# EasyEDA Pro project ProPrj_Inverted_MAML_6x6_2026-08-15.epro, schematic DAC_8BIT
Create Date: 2026-06-15; Page Name: P1; Project Name: Inverted_MAML_6x6; Schematic Name: Schematic1; Update Date: 2026-06-15; Company: EasyEDA.com; Drawn: Olle Welin; Page Size: A4; Version: V1.0
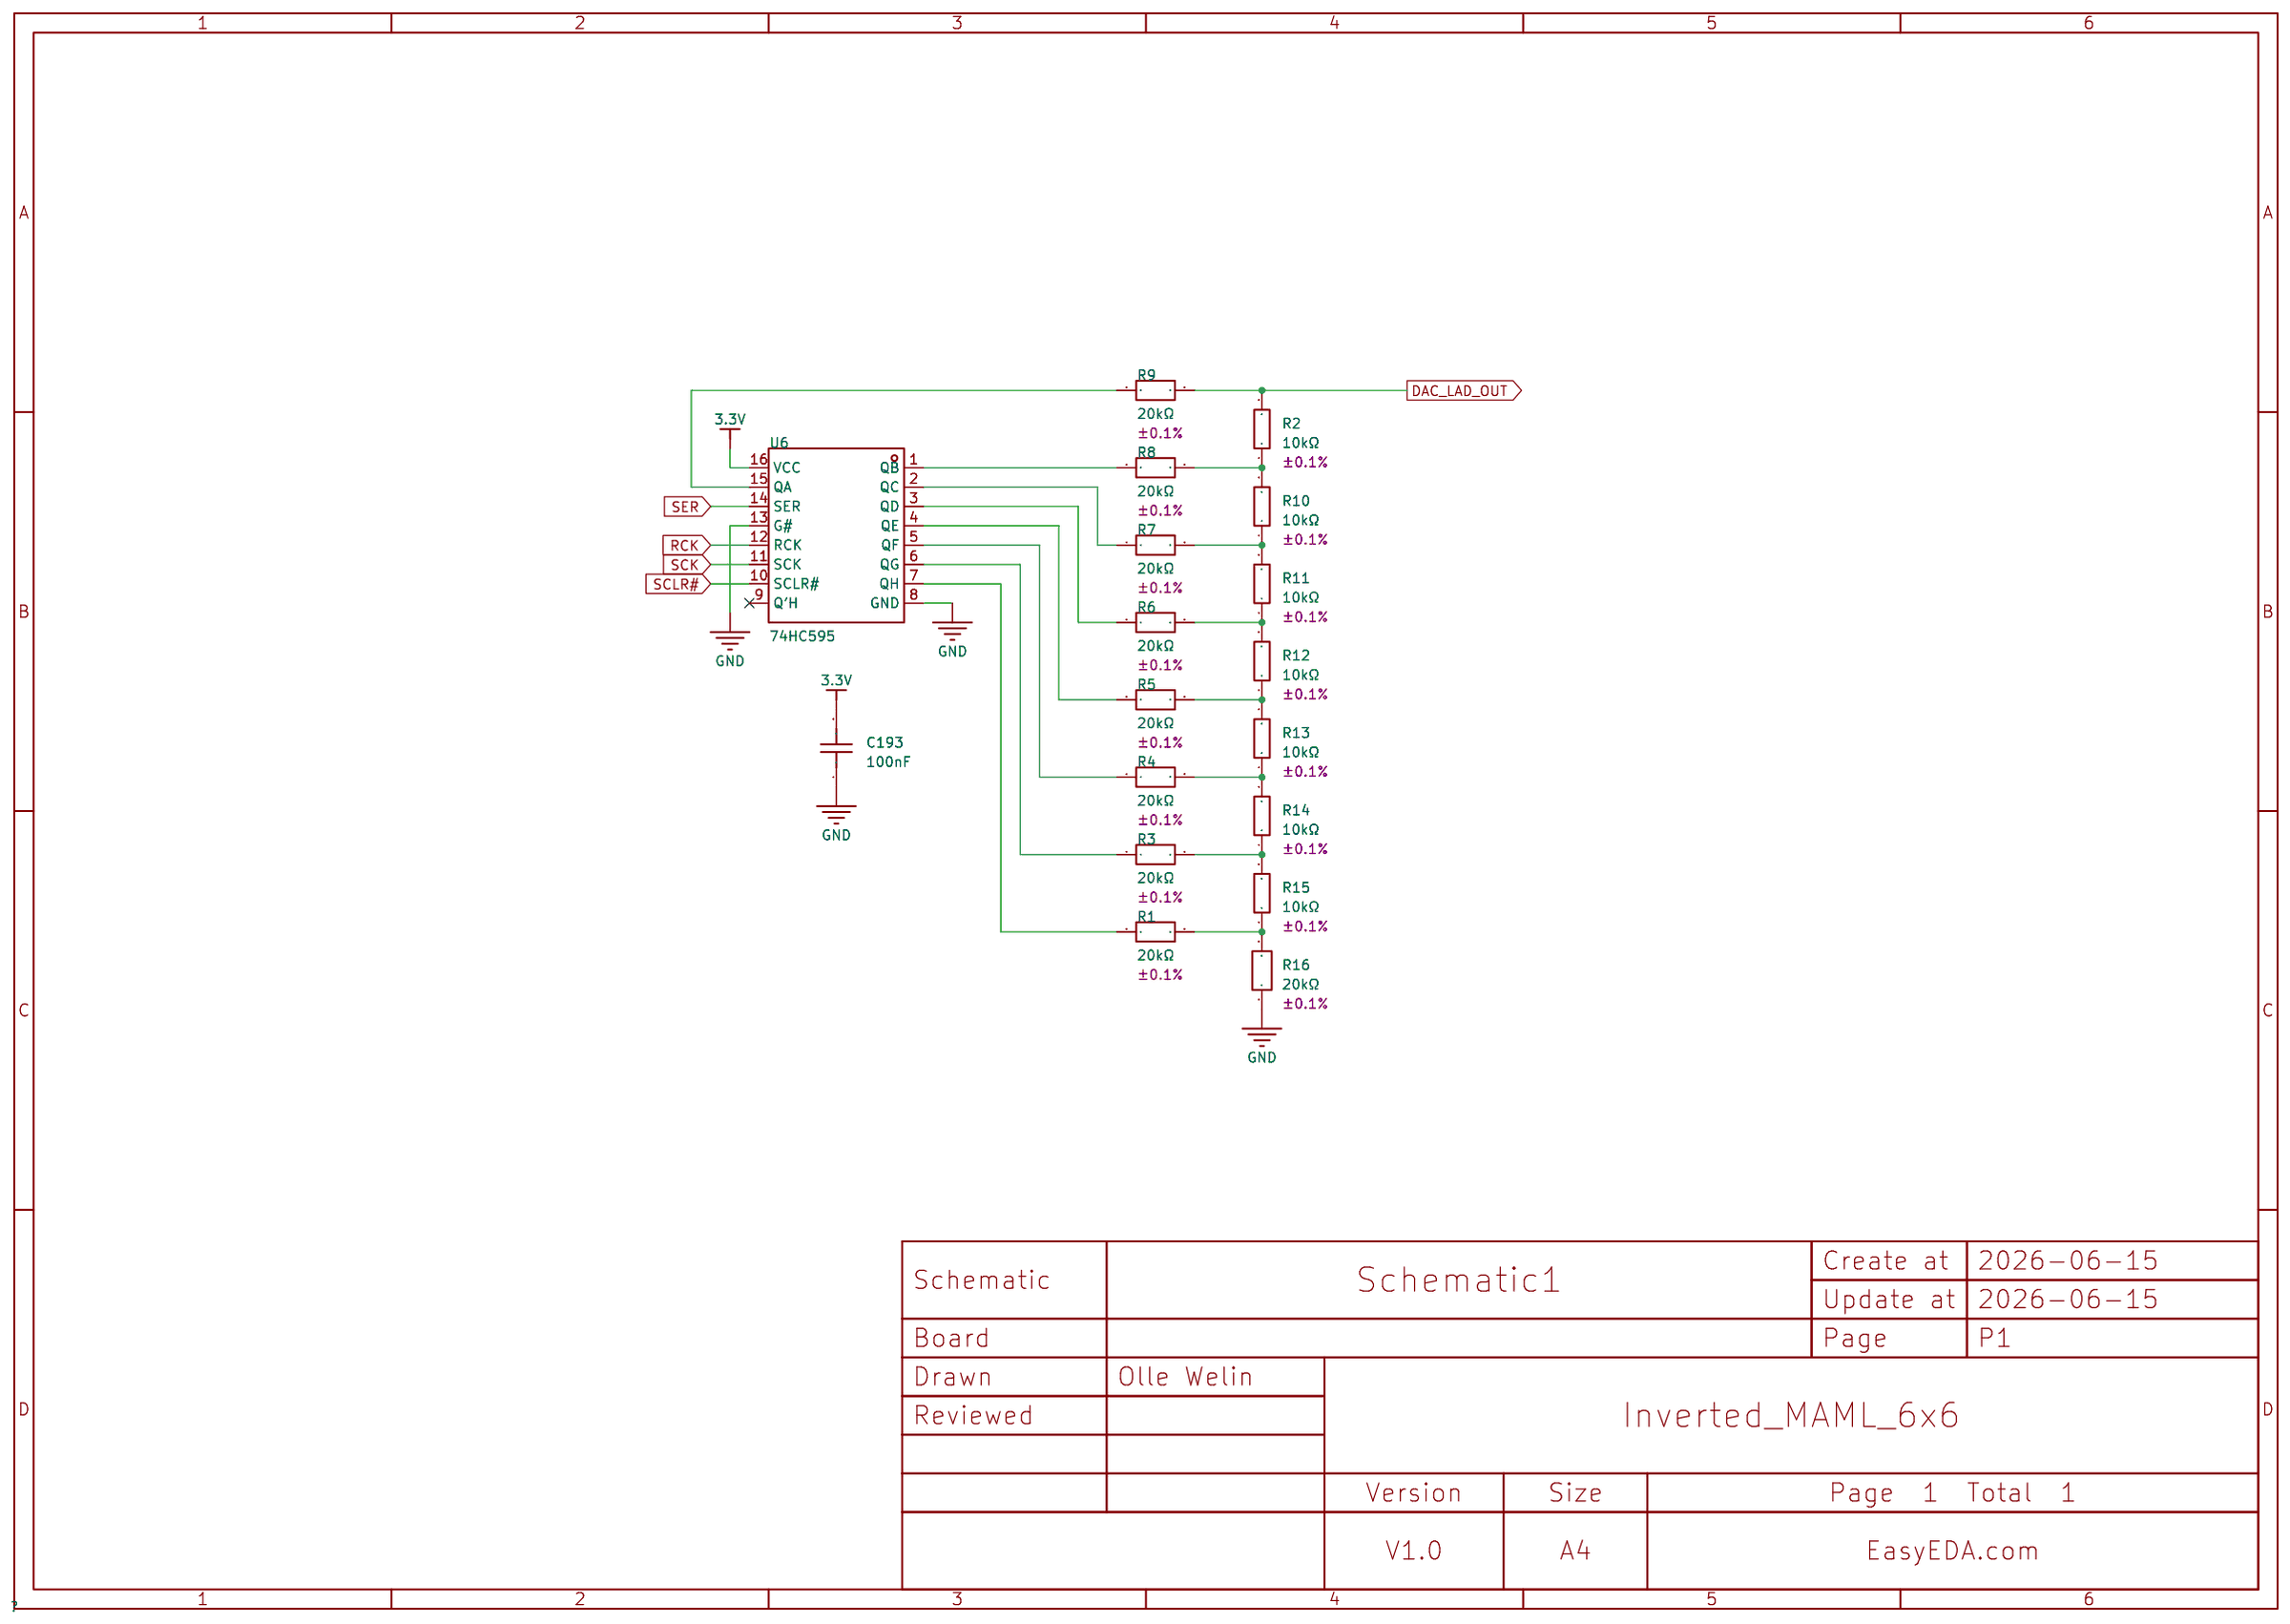
[diagram p6: schematic sheet]

## Parts
C193  100nF  [C0402]
R1  20kΩ  [R0402]
R2  10kΩ  [R0402]
R3  20kΩ  [R0402]
R4  20kΩ  [R0402]
R5  20kΩ  [R0402]
R6  20kΩ  [R0402]
R7  20kΩ  [R0402]
R8  20kΩ  [R0402]
R9  20kΩ  [R0402]
R10  10kΩ  [R0402]
R11  10kΩ  [R0402]
R12  10kΩ  [R0402]
R13  10kΩ  [R0402]
R14  10kΩ  [R0402]
R15  10kΩ  [R0402]
R16  20kΩ  [R0402]
U6  74HC595  [SOP-16_L9.9-W3.9-P1.27-LS6.0-BL]

## Library data of the parts
C193 = CL05B104KO5NNNC: Capacitance:100nF Tolerance:±10% Tolerance:±10% Voltage Rating:16V Temperature Coefficient:X7R; LCSC Part Name: 100nF ±10% 16V; Supplier Part: C1525; Manufacturer: SAMSUNG(三星); Supplier Footprint: 0402; JLCPCB Part Class: Basic Part; Datasheet: https://item.szlcsc.com/datasheet/CL05B104KO5NNNC/1877.html; Supplier: LCSC; Tolerance: ±10%; Voltage Rating: 16V; Temperature Coefficient: X7R
R1 R3-R9 R16 = ARG02BTC2002: Type:Thin Film Resistor Resistance:20kΩ Tolerance:±0.1% Tolerance:±0.1% Power(Watts):62.5mW Voltage-Supply(Max):50V Temperature Coefficient:±25ppm/℃ Temperature Coefficient:±25ppm/℃ Operating Temperature:-55℃~+155℃ Operating Temperature:-55℃~+155℃; LCSC Part Name: 薄膜电阻 20kΩ ±0.1% 62.5mW; Supplier Part: C2984413; Manufacturer: Viking(光颉); Supplier Footprint: 0402; JLCPCB Part Class: Extended Part; Datasheet: https://item.szlcsc.com/datasheet/ARG02BTC2002/3425948.html; Supplier: LCSC; Type: Thin Film Resistor; Tolerance: ±0.1%; Power(Watts): 62.5mW; Voltage-Supply(Max): 50V; Temperature Coefficient: ±25ppm/℃; Operating Temperature: -55℃~+155℃
R2 R10-R15 = RT0402BRD0710KL: Type:Thin Film Resistor Resistance:10kΩ Tolerance:±0.1% Tolerance:±0.1% Power(Watts):62.5mW Voltage-Supply(Max):50V Temperature Coefficient:±25ppm/℃ Temperature Coefficient:±25ppm/℃ Operating Temperature:-55℃~+155℃ Operating Temperature:-55℃~+155℃; LCSC Part Name: 薄膜电阻 10kΩ ±0.1% 62.5mW; Supplier Part: C190095; Manufacturer: YAGEO(国巨); Supplier Footprint: 0402; JLCPCB Part Class: Extended Part; Datasheet: https://item.szlcsc.com/datasheet/RT0402BRD0710KL/208478.html; Supplier: LCSC; Type: Thin Film Resistor; Tolerance: ±0.1%; Power(Watts): 62.5mW; Voltage-Supply(Max): 50V; Temperature Coefficient: ±25ppm/℃; Operating Temperature: -55℃~+155℃
U6 = 74HC595: Function:Serial-to-Serial or Parallel Voltage - Supply:2V~6V Voltage - Supply:2V~6V Clock Frequency:10MHz Number of Elements:1 Number of Bits per Element:8 Output Type:Tri-State Series:74HC Operating Temperature:-40℃~+85℃ Operating Temperature:-40℃~+85℃ P; LCSC Part Name: 8位CMOS移位寄存器; Supplier Part: C18164493; Manufacturer: GR(国睿); Supplier Footprint: SOP-16; Datasheet: https://item.szlcsc.com/datasheet/74HC595/19305556.html; Supplier: LCSC; Function: Serial-to-Serial or Parallel; Voltage - Supply: 2V~6V; Clock Frequency: 10MHz; Number of Elements: 1; Number of Bits per Element: 8; Output Type: Tri-State; Series: 74HC; Operating Temperature: -40℃~+85℃; Propagation Delay: 100ns@5V,50pF

## Nets
3.3V: C193.2 U6.16(VCC)
GND: C193.1 R16.1 U6.8(GND) U6.13(G#)
DAC_LAD_OUT: R2.2 R9.2
RCK: U6.12(RCK)
SCK: U6.11(SCK)
SCLR#: U6.10(SCLR#)
SER: U6.14(SER)
Net-(R1-1): R1.1 U6.7(QH)
Net-(R1-2): R1.2 R15.1 R16.2
Net-(R2-1): R2.1 R8.2 R10.2
Net-(R3-1): R3.1 U6.6(QG)
Net-(R3-2): R3.2 R14.1 R15.2
Net-(R4-1): R4.1 U6.5(QF)
Net-(R4-2): R4.2 R13.1 R14.2
Net-(R5-1): R5.1 U6.4(QE)
Net-(R5-2): R5.2 R12.1 R13.2
Net-(R6-1): R6.1 U6.3(QD)
Net-(R6-2): R6.2 R11.1 R12.2
Net-(R7-1): R7.1 U6.2(QC)
Net-(R7-2): R7.2 R10.1 R11.2
Net-(R8-1): R8.1 U6.1(QB)
Net-(R9-1): R9.1 U6.15(QA)

Not connected (* = marked no-connect by the designer): U6 9(Q′H)*
